# Altium schematic sheet F1C100s.SchDoc
size A3; SheetNumber: 3; SheetTotal: 9
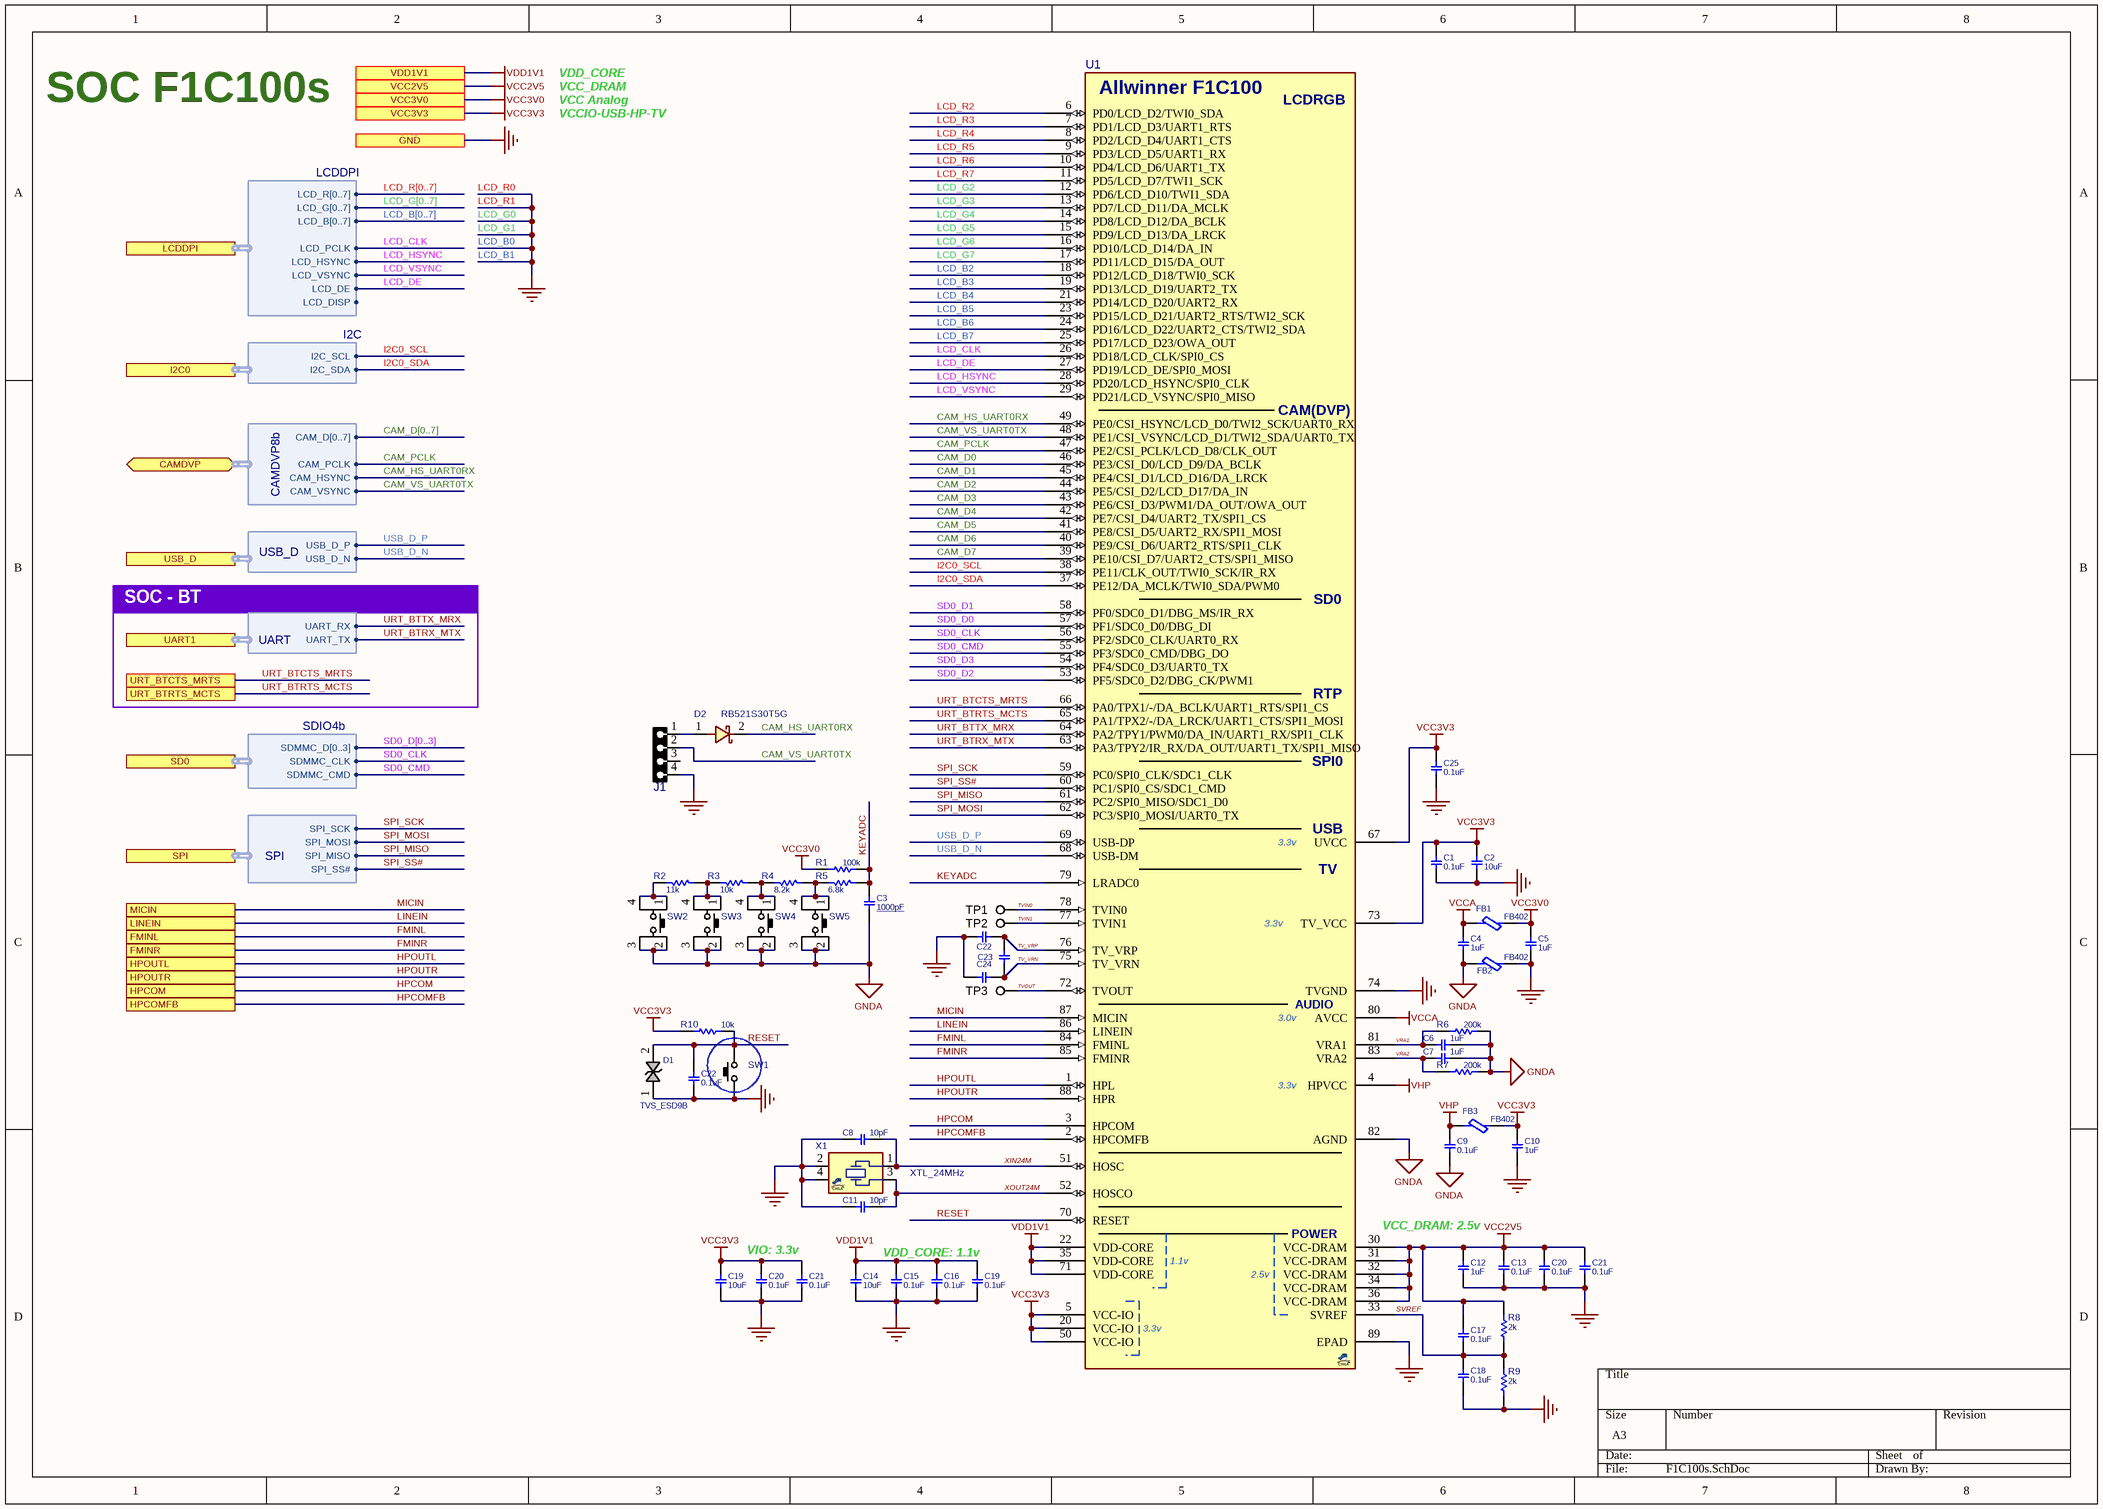
[diagram p0: F1C100s.SchDoc]

## Parts
(Parts that share a designator on the sheet are numbered #1, #2 ... from top to bottom, then left to right.)
C1  0.1uF  [C0402]
C2  10uF  [C0402]
C3  1000pF  [C0402]
C4  1uF  [C0402]
C5  1uF  [C0402]
C6  1uF  [C0402]
C7  1uF  [C0402]
C8  10pF  [C0402]
C9  0.1uF  [C0402]
C10  1uF  [C0402]
C11  10pF  [C0402]
C12  1uF  [C0402]
C13  0.1uF  [C0402]
C14  10uF  [C0402]
C15  0.1uF  [C0402]
C16  0.1uF  [C0402]
C17  0.1uF  [C0402]
C18  0.1uF  [C0402]
C19#1  10uF  [C0402]
C19#2  0.1uF  [C0402]
C20#1  0.1uF  [C0402]
C20#2  0.1uF  [C0402]
C21#1  0.1uF  [C0402]
C21#2  0.1uF  [C0402]
C22#1  DNP/10uF  [C0402]  (value not drawn)
C22#2  0.1uF  [C0402]
C23  DNP/10uF  [C0402]  (value not drawn)
C24  DNP/10uF  [C0402]  (value not drawn)
C25  0.1uF  [C0402]
D1  TVS_ESD9B  [D_SOD923]
D2  RB521S30T5G  [D_SOD523]
FB1  FB402  [L0402]
FB2  FB402  [L0402]
FB3  FB402  [L0402]
J1  HDR1X4  [HDR127MAG_4]  (value not drawn)
R1  100k  [R0402]
R2  11k  [R0402]
R3  10k  [R0402]
R4  8.2k  [R0402]
R5  6.8k  [R0402]
R6  200k  [R0402]
R7  200k  [R0402]
R8  2k  [R0402]
R9  2k  [R0402]
R10  10k  [R0402]
SW1  PUSHBUTTON  [SWPBS_SPST_3X2X1]  (value not drawn)
SW2  PUSHBUTTON  [SWPBS_SPDT_R_KMS]  (value not drawn)
SW3  PUSHBUTTON  [SWPBS_SPDT_R_KMS]  (value not drawn)
SW4  PUSHBUTTON  [SWPBS_SPDT_R_KMS]  (value not drawn)
SW5  PUSHBUTTON  [SWPBS_SPDT_R_KMS]  (value not drawn)
TP1  TESTPOINT_PROBE  [TP80D50]  (value not drawn)  (no BOM)
TP2  TESTPOINT_PROBE  [TP80D50]  (value not drawn)  (no BOM)
TP3  TESTPOINT_PROBE  [TP80D50]  (value not drawn)  (no BOM)
U1  Allwinner F1C100s  [QFN40_88T]  (value not drawn)
X1  XTL_24MHz  [XTL_4_2016]

## Ports
CAMDVP (bidir, harness CAMDVP8b), FMINL, FMINR, GND, HPCOM, HPCOMFB, HPOUTL, HPOUTR, I2C0 (harness I2C), LCDDPI (harness LCDDPI), LINEIN, MICIN, SD0 (harness SDIO4b), SPI (harness SPI), UART1 (harness UART), URT_BTCTS_MRTS, URT_BTRTS_MCTS, USB_D (harness USB_D), VCC2V5, VCC3V0, VCC3V3, VDD1V1

## Harnesses
LCDDPI: LCD_PCLK, LCD_HSYNC, LCD_VSYNC, LCD_DE, LCD_R[0..7], LCD_G[0..7], LCD_B[0..7], LCD_DISP
UART: UART_RX, UART_TX
SPI: SPI_SCK, SPI_MOSI, SPI_MISO, SPI_SS#
I2C: I2C_SCL, I2C_SDA
USB_D: USB_D_P, USB_D_N
SDIO4b: SDMMC_CMD, SDMMC_D[0..3], SDMMC_CLK
CAMDVP8b: CAM_D[0..7], CAM_PCLK, CAM_HSYNC, CAM_VSYNC

## Nets
GNDA: C3.1 C4.2 C6.2 C7.2 C9.1 FB2.2 R6.1 R7.1 SW2.2 SW2.3 SW3.2 SW3.3 SW4.2 SW4.3 SW5.2 SW5.3 U1.82(AGND)
LCD_B0: C1.1 C2.2 C5.2 C8.2 C10.2 C11.2 C12.2 C13.1 C14.2 C15.1 C16.1 C18.1 C19#1.2 C19#2.1 C20#1.1 C20#2.1 C21#1.1 C21#2.1 C22#1.1 C22#2.1 C24.1 C25.1 D1.1 FB2.1 J1.4 R9.2 SW1.1(P1) U1.74(TVGND) U1.89(EPAD) X1.2 X1.4 ; port GND  [also labelled GND, LCD_B1, LCD_G0, LCD_G1, LCD_R0, LCD_R1]
VCC2V5: C12.1 C13.2 C17.2 C20#1.2 C21#1.2 R8.1 U1.30(VCC-DRAM) U1.31(VCC-DRAM) U1.32(VCC-DRAM) U1.34(VCC-DRAM) U1.36(VCC-DRAM) ; port VCC2V5
VCC3V0: C5.1 FB1.1 R1.2 ; port VCC3V0
VCC3V3: C1.2 C2.1 C10.1 C19#1.1 C20#2.2 C21#2.2 C25.2 FB3.1 R10.2 U1.5(VCC-IO) U1.20(VCC-IO) U1.50(VCC-IO) U1.67(UVCC) U1.73(TV_VCC) ; port VCC3V3
VCCA: C4.1 FB1.2 U1.80(AVCC)
VDD1V1: C14.1 C15.2 C16.2 C19#2.2 U1.22(VDD-CORE) U1.35(VDD-CORE) U1.71(VDD-CORE) ; port VDD1V1
VHP: C9.2 FB3.2 U1.4(HPVCC)
CAM_D0: U1.46(PE3/CSI_D0/LCD_D9/DA_BCLK)
CAM_D1: U1.45(PE4/CSI_D1/LCD_D16/DA_LRCK)
CAM_D2: U1.44(PE5/CSI_D2/LCD_D17/DA_IN)
CAM_D3: U1.43(PE6/CSI_D3/PWM1/DA_OUT/OWA_OUT)
CAM_D4: U1.42(PE7/CSI_D4/UART2_TX/SPI1_CS)
CAM_D5: U1.41(PE8/CSI_D5/UART2_RX/SPI1_MOSI)
CAM_D6: U1.40(PE9/CSI_D6/UART2_RTS/SPI1_CLK)
CAM_D7: U1.39(PE10/CSI_D7/UART2_CTS/SPI1_MISO)
CAM_HS_UART0RX: D2.2 U1.49(PE0/CSI_HSYNC/LCD_D0/TWI2_SCK/UART0_RX) ; port CAMDVP.CAM_HSYNC
CAM_PCLK: U1.47(PE2/CSI_PCLK/LCD_D8/CLK_OUT) ; port CAMDVP.CAM_PCLK
CAM_VS_UART0TX: J1.2 U1.48(PE1/CSI_VSYNC/LCD_D1/TWI2_SDA/UART0_TX) ; port CAMDVP.CAM_VSYNC
FMINL: U1.84(FMINL) ; port FMINL
FMINR: U1.85(FMINR) ; port FMINR
HPCOM: U1.3(HPCOM) ; port HPCOM
HPCOMFB: U1.2(HPCOMFB) ; port HPCOMFB
HPOUTL: U1.1(HPL) ; port HPOUTL
HPOUTR: U1.88(HPR) ; port HPOUTR
I2C0_SCL: U1.38(PE11/CLK_OUT/TWI0_SCK/IR_RX) ; port I2C0.I2C_SCL
I2C0_SDA: U1.37(PE12/DA_MCLK/TWI0_SDA/PWM0) ; port I2C0.I2C_SDA
KEYADC: C3.2 R1.1 R5.1 U1.79(LRADC0)
LCD_B2: U1.18(PD12/LCD_D18/TWI0_SCK)
LCD_B3: U1.19(PD13/LCD_D19/UART2_TX)
LCD_B4: U1.21(PD14/LCD_D20/UART2_RX)
LCD_B5: U1.23(PD15/LCD_D21/UART2_RTS/TWI2_SCK)
LCD_B6: U1.24(PD16/LCD_D22/UART2_CTS/TWI2_SDA)
LCD_B7: U1.25(PD17/LCD_D23/OWA_OUT)
LCD_CLK: U1.26(PD18/LCD_CLK/SPI0_CS) ; port LCDDPI.LCD_PCLK
LCD_DE: U1.27(PD19/LCD_DE/SPI0_MOSI) ; port LCDDPI.LCD_DE
LCD_G2: U1.12(PD6/LCD_D10/TWI1_SDA)
LCD_G3: U1.13(PD7/LCD_D11/DA_MCLK)
LCD_G4: U1.14(PD8/LCD_D12/DA_BCLK)
LCD_G5: U1.15(PD9/LCD_D13/DA_LRCK)
LCD_G6: U1.16(PD10/LCD_D14/DA_IN)
LCD_G7: U1.17(PD11/LCD_D15/DA_OUT)
LCD_HSYNC: U1.28(PD20/LCD_HSYNC/SPI0_CLK) ; port LCDDPI.LCD_HSYNC
LCD_R2: U1.6(PD0/LCD_D2/TWI0_SDA)
LCD_R3: U1.7(PD1/LCD_D3/UART1_RTS)
LCD_R4: U1.8(PD2/LCD_D4/UART1_CTS)
LCD_R5: U1.9(PD3/LCD_D5/UART1_RX)
LCD_R6: U1.10(PD4/LCD_D6/UART1_TX)
LCD_R7: U1.11(PD5/LCD_D7/TWI1_SCK)
LCD_VSYNC: U1.29(PD21/LCD_VSYNC/SPI0_MISO) ; port LCDDPI.LCD_VSYNC
LINEIN: U1.86(LINEIN) ; port LINEIN
MICIN: U1.87(MICIN) ; port MICIN
RESET: C22#2.2 D1.2 R10.1 SW1.2(P3) U1.70(RESET)
SD0_CLK: U1.56(PF2/SDC0_CLK/UART0_RX) ; port SD0.SDMMC_CLK
SD0_CMD: U1.55(PF3/SDC0_CMD/DBG_DO) ; port SD0.SDMMC_CMD
SD0_D0: U1.57(PF1/SDC0_D0/DBG_DI)
SD0_D1: U1.58(PF0/SDC0_D1/DBG_MS/IR_RX)
SD0_D2: U1.53(PF5/SDC0_D2/DBG_CK/PWM1)
SD0_D3: U1.54(PF4/SDC0_D3/UART0_TX)
SPI_MISO: U1.61(PC2/SPI0_MISO/SDC1_D0) ; port SPI.SPI_MISO
SPI_MOSI: U1.62(PC3/SPI0_MOSI/UART0_TX) ; port SPI.SPI_MOSI
SPI_SCK: U1.59(PC0/SPI0_CLK/SDC1_CLK) ; port SPI.SPI_SCK
SPI_SS#: U1.60(PC1/SPI0_CS/SDC1_CMD) ; port SPI.SPI_SS#
SVREF: C17.1 C18.2 R8.2 R9.1 U1.33(SVREF)
TV_VRN: C23.1 C24.2 U1.75(TV_VRN)
TV_VRP: C22#1.2 C23.2 U1.76(TV_VRP)
TVIN0: TP1.1 U1.78(TVIN0)
TVIN1: TP2.1 U1.77(TVIN1)
TVOUT: TP3.1 U1.72(TVOUT)
URT_BTCTS_MRTS: U1.66(PA0/TPX1/-/DA_BCLK/UART1_RTS/SPI1_CS) ; port URT_BTCTS_MRTS
URT_BTRTS_MCTS: U1.65(PA1/TPX2/-/DA_LRCK/UART1_CTS/SPI1_MOSI) ; port URT_BTRTS_MCTS
URT_BTRX_MTX: U1.63(PA3/TPY2/IR_RX/DA_OUT/UART1_TX/SPI1_MISO) ; port UART1.UART_TX
URT_BTTX_MRX: U1.64(PA2/TPY1/PWM0/DA_IN/UART1_RX/SPI1_CLK) ; port UART1.UART_RX
USB_D_N: U1.68(USB-DM) ; port USB_D.USB_D_N
USB_D_P: U1.69(USB-DP) ; port USB_D.USB_D_P
VRA1: C6.1 R6.2 U1.81(VRA1)
VRA2: C7.1 R7.2 U1.83(VRA2)
XIN24M: C8.1 U1.51(HOSC) X1.1
XOUT24M: C11.1 U1.52(HOSCO) X1.3
NetD2_1: D2.1 J1.1
NetR2_1: R2.1 R3.2 SW3.1 SW3.4
NetR2_2: R2.2 SW2.1 SW2.4
NetR3_1: R3.1 R4.2 SW4.1 SW4.4
NetR4_1: R4.1 R5.2 SW5.1 SW5.4

Not connected (* = marked no-connect by the designer): J1 3

## Buses and harness runs
bus CAM_D[0..7]
bus LCD_B[0..7]
bus LCD_G[0..7]
bus LCD_R[0..7]
bus SD0_D[0..3]

## Notes on the sheet
- SOC F1C100s
- VDD_CORE
- VCC_DRAM
- VCC Analog
- VCCIO-USB-HP-TV
- SOC - BT
- VIO: 3.3v
- VDD_CORE: 1.1v
- VCC_DRAM: 2.5v
- (in symbol F1C100s_QFN88) Allwinner F1C100; LCDRGB; CAM(DVP); SD0; RTP; SPI0; USB; 3.3v; TV; AUDIO; 3.0v; POWER; 1.1v; 2.5v

## Library data of the parts
C1 C9 C13 C15-C18 C19#2 C20#1 C20#2 C21#1 C21#2 C25 = CAP_SMD_MLCC: CAP, MLCC; PARAM: X7R, 10%, -55~125oC; MANF_P#: GRM155R71H104KE14D; MANF: Murata; PARAM2: 50v; PRICE: 100: 0.018$; ASSEMBLY: ASSEMBLY; VALUE: 0.1uF
C2 C14 C19#1 C22#1 C23 C24 = CAP_SMD_MLCC: CAP, MLCC; PARAM: X5R, 10%; MANF_P#: GRM155R60J106ME15; MANF: Murata; PARAM2: 6.3v; PRICE: 10,000: $0.034; ASSEMBLY: ASSEMBLY
  C2 C14 C19#1: VALUE: 10uF
  C22#1 C23 C24: VALUE: DNP/10uF
C3 = CAP_SMD_MLCC_0603: CAP, MLCC; PARAM: -, -%; MANF_P#: MANF_PART#; PARAM2: -V; PRICE: 100= 1$; MANF: -; ASSEMBLY: ASSEMBLY; VALUE: 1000pF
C4-C7 C10 C12 = CAP_SMD_MLCC: CAP, MLCC; PARAM: X5R, 10%; MANF_P#: GMK105ABJ105KV-F; MANF: Taiyo Yuden; PARAM2: 35v; PRICE: 100: 0.06$; ASSEMBLY: ASSEMBLY; VALUE: 1uF
C8 C11 = CAP_SMD_MLCC: CAP, MLCC; PARAM: C0G, 5%; MANF_P#: CC0402JRNPO9BN180; MANF: Yageo; PARAM2: 50v; PRICE: 100: 0.009$; ASSEMBLY: ASSEMBLY; VALUE: 10pF
C22#2 = CAP_SMD_MLCC: CAP, MLCC; PARAM: X5R, 10%; MANF_P#: CL03A104KP3NNWC; MANF: Samsung; PARAM2: 10v; PRICE: 10,000:$0.006; ASSEMBLY: ASSEMBLY; VALUE: 0.1uF
D1 = TVS_ESD9B3.3: TVS, ESD PROTECT, Bidirectional; MANF_P#: ESD9B3.3ST5G; MANF: ON; PARAM: 3.3VRWM; VALUE: TVS_ESD9B
D2 = DIODE_SMD_SCHOTTKY_1N5819: DIODE, SCHOTTKY; MANF: DIODES; DESC: DESCRIPTION; PARAM2: 0.2A; PARAM: 30V; MANF_P#: RB521S30T5G; ASSEMBLY: ASSEMBLY; PRICE: PRICE; VALUE: RB521S30T5G
FB1-FB3 = FBEAD_SMD_BLM15PD121: FERRITE_Bead, 0402, 0.5A, 200mOhm, 120@100MHz; MANF: MURATA; MANF_P#: BLM15AG121SN1D; PARAM: 120@100MHz; PARAM2: 0.5A, 200mOhm; VALUE: FB402
J1 = HDRMINI_F_1X4: CONN, HEADER, Female, pitch: 1.27mm, 4POS; VALUE: HDRMINI_4
R1-R7 = RES_SMD_0603: RESISTOR, SMD; PARAM: -W; DESC: DESCRIPTION; DIST#: MOUSER; PARAM2: 1%; MANF_P#: -; MANF: -; ASSEMBLY: ASSEMBLY; PRICE: 100= 0.5$
  R1: VALUE: 100k
  R2: VALUE: 11k
  R3: VALUE: 10k
  R4: VALUE: 8.2k
  R5: VALUE: 6.8k
  R6 R7: VALUE: 200k
R8-R10 = RES_SMD: RESISTOR, SMD; PARAM: 0.063W; DESC: DESCRIPTION; DIST#: MOUSER; PARAM2: 1%; MANF_P#: -; MANF: -; ASSEMBLY: ASSEMBLY; PRICE: 100= 0.3$
  R8 R9: VALUE: 2k
  R10: VALUE: 10k
SW1 = SWPBS_SPST_3X2_B3U-1000P: SWITCH, PUSH BUTTON, TACTILE, SMD, SPST, 3X2.5X1.2mm; MANF: OMRON; DESC: DESCRIPTION; VALUE: PUSHBUTTON; ASSEMBLY: ASSEMBLY; PARAM: PARAM; PRICE: 1$; MANF_P#: B3U-1000P
SW2-SW5 = SWPBS_SPDT_R_CK: SWITCH, PUSH BUTTON, TACTILE, THD, SPDT, RIGHT; PARAM: 50mA/32VDC; DESC: DESCRIPTION; MANF_P#: SKSCPCE010, ST-1186BE, GT-TC045A-H036-L1A, TS-1085S-B3, GT-TC045B-H036-L1A, EVQP7C01P, SKSCLDE010, EVQP7C01P, GT-TC041B-H036-L1N, GT-TC041A-H036-L1A, GT-TC047B-H016-L1A, KMS221GLFS; MANF: -; VALUE: PUSHBUTTON; ASSEMBLY: ASSEMBLY; PRICE: 0.07$
TP1-TP3 = TESTPOINT_PROBE: TEST POINT; MANF: MANF; MANF_P#: MANF_P#; VALUE: VALUE
U1 = F1C100s_QFN88: processor, ARM926EJ-S 533MHz w 32MB DDR1; MANF: Allwinner; MANF_P#: F1C100s; PARAM: ARM926EJ-S 533MHz w 32MB DDR1; VALUE: Allwinner F1C100s
X1 = XTL_4_40MHz_3225A: CRYSTAL; MANF: Murata; PARAM: -20~70oC; DIST#: MOUSER; PARAM2: 10PPM, 6pF; MANF_P#: XRCGB24M000F1H17R0; ASSEMBLY: ASSEMBLY; PRICE: 0.4$; VALUE: XTL_24MHz